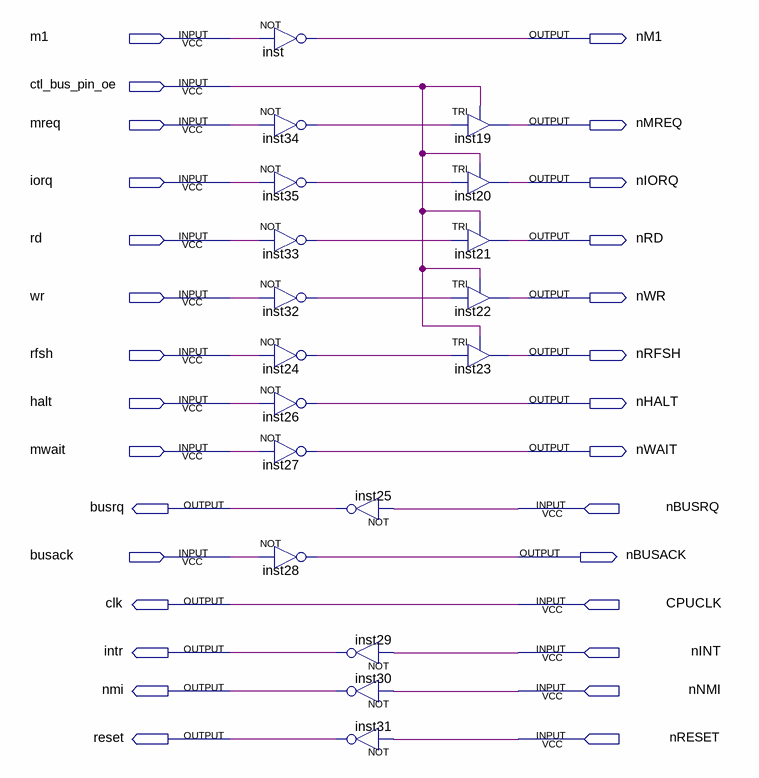
[diagram p0: schematic sheet]
// Quartus schematic control_pins.bdf as structural Verilog: 18 symbols, 29 pins
module control_pins (
  input  m1,
  input  ctl_bus_pin_oe,
  input  mreq,
  input  iorq,
  input  rd,
  input  wr,
  input  rfsh,
  input  halt,
  input  mwait,
  input  nBUSRQ,
  input  busack,
  input  CPUCLK,
  input  nINT,
  input  nNMI,
  input  nRESET,
  output nM1,
  output nMREQ,
  output nIORQ,
  output nRD,
  output nWR,
  output nRFSH,
  output nHALT,
  output nWAIT,
  output busrq,
  output nBUSACK,
  output clk,
  output intr,
  output nmi,
  output reset
);

  wire inst24_out, inst32_out, inst33_out, inst34_out, inst35_out;

  not inst (nM1, m1);
  not inst34 (inst34_out, mreq);
  not inst35 (inst35_out, iorq);
  not inst33 (inst33_out, rd);
  not inst32 (inst32_out, wr);
  not inst24 (inst24_out, rfsh);
  not inst26 (nHALT, halt);
  not inst27 (nWAIT, mwait);
  not inst28 (nBUSACK, busack);
  not inst25 (busrq, nBUSRQ);
  not inst29 (intr, nINT);
  not inst30 (nmi, nNMI);
  not inst31 (reset, nRESET);
  TRI inst19 (.IN(inst34_out), .OE(ctl_bus_pin_oe), .OUT(nMREQ));
  TRI inst20 (.IN(inst35_out), .OE(ctl_bus_pin_oe), .OUT(nIORQ));
  TRI inst21 (.IN(inst33_out), .OE(ctl_bus_pin_oe), .OUT(nRD));
  TRI inst22 (.IN(inst32_out), .OE(ctl_bus_pin_oe), .OUT(nWR));
  TRI inst23 (.IN(inst24_out), .OE(ctl_bus_pin_oe), .OUT(nRFSH));

  assign clk = CPUCLK;
endmodule
